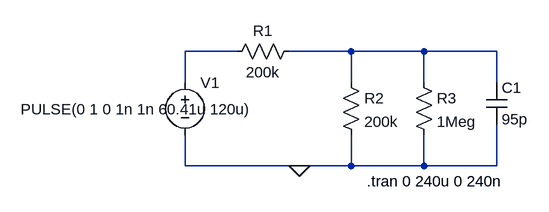
[diagram p0: schematic Exp4Part1c.asc]
Exp4Part1c.asc, the LTspice schematic file:
Version 4
SHEET 1 880 680
WIRE 64 -16 -16 -16
WIRE 240 -16 144 -16
WIRE 352 -16 240 -16
WIRE 464 -16 352 -16
WIRE -16 32 -16 -16
WIRE 240 32 240 -16
WIRE 352 32 352 -16
WIRE 464 32 464 -16
WIRE -16 160 -16 112
WIRE 160 160 -16 160
WIRE 240 160 240 112
WIRE 240 160 160 160
WIRE 352 160 352 112
WIRE 352 160 240 160
WIRE 464 160 464 96
WIRE 464 160 352 160
FLAG 160 160 0
SYMBOL res 160 -32 R90
WINDOW 0 0 56 VBottom 2
WINDOW 3 32 56 VTop 2
SYMATTR InstName R1
SYMATTR Value 200k
SYMBOL res 224 16 R0
SYMATTR InstName R2
SYMATTR Value 200k
SYMBOL voltage -16 16 R0
WINDOW 3 -253 57 Left 2
WINDOW 123 -105 43 Left 2
WINDOW 39 0 0 Left 0
SYMATTR InstName V1
SYMATTR Value PULSE(0 1 0 1n 1n 60.41u 120u)
SYMBOL res 336 16 R0
SYMATTR InstName R3
SYMATTR Value 1Meg
SYMBOL cap 448 32 R0
SYMATTR InstName C1
SYMATTR Value 95p
TEXT 264 184 Left 2 !.tran 0 240u 0 240n

The netlist it stands for:
* Exp4Part1c.asc
R1 N002 N001 200k
R2 N002 0 200k
V1 N001 0 PULSE(0 1 0 1n 1n 60.41u 120u)
R3 N002 0 1Meg
C1 N002 0 95p
.tran 0 240u 0 240n
.backanno
.end